# Altium schematic sheet 02_Battery.SchDoc
size A4
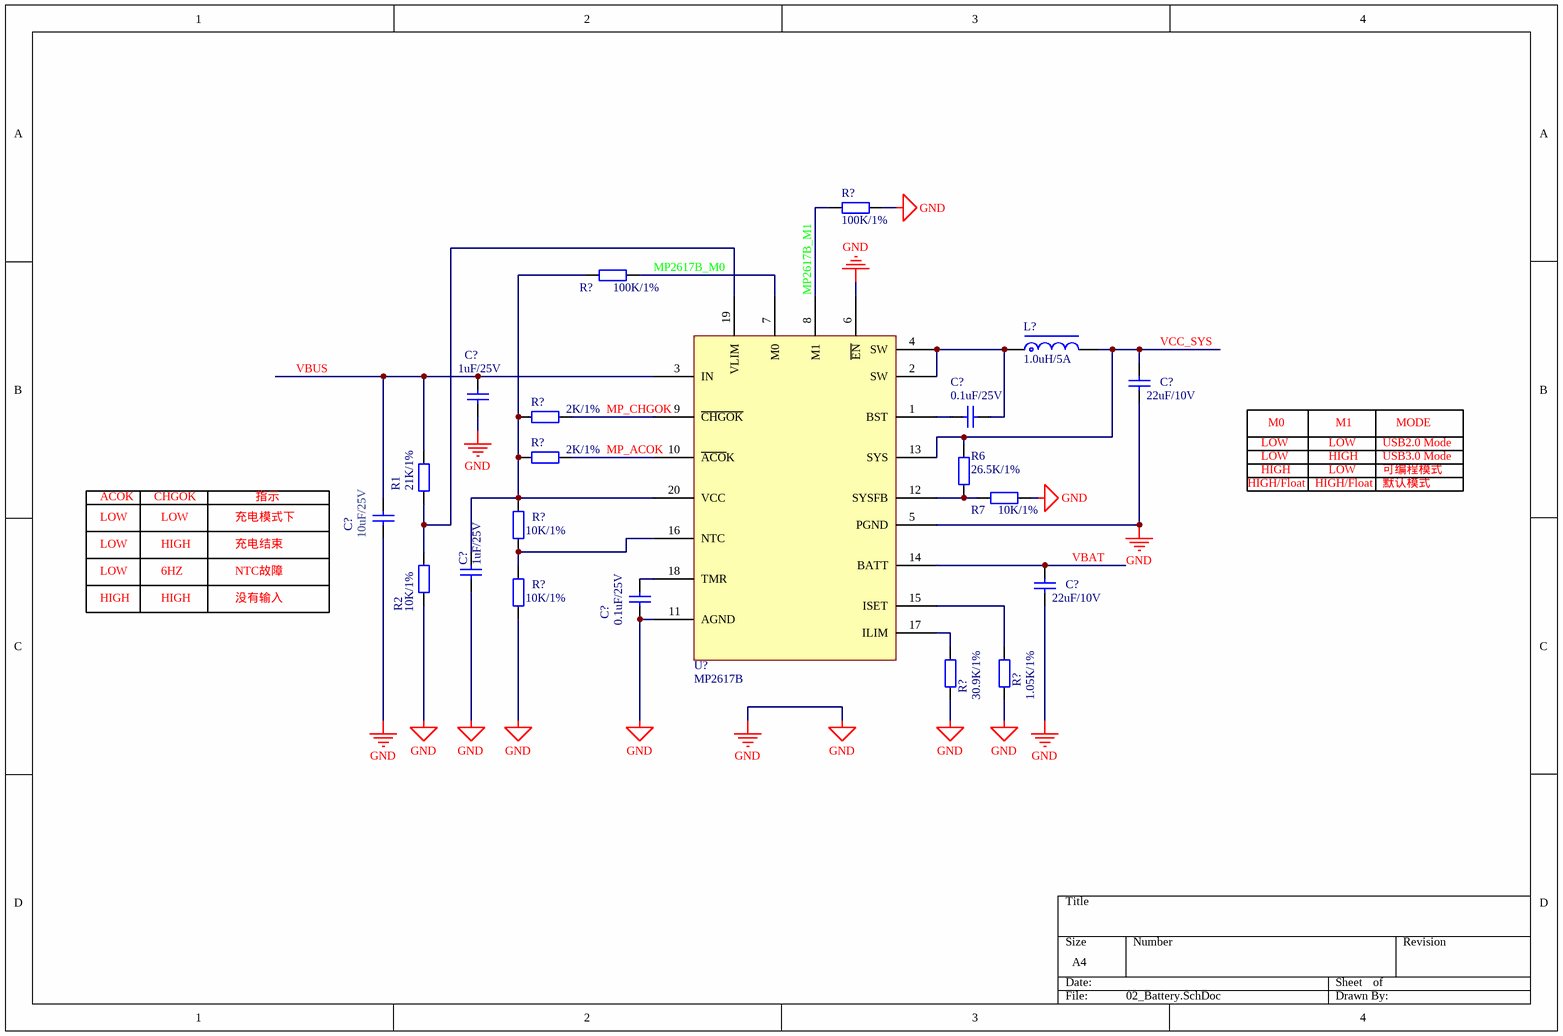
[diagram p0: 02_Battery.SchDoc]

## Parts
(Parts that share a designator on the sheet are numbered #1, #2 ... from top to bottom, then left to right.)
C?#1  22uF/10V  [C0603_L]
C?#2  1uF/25V  [C0402_L]
C?#3  0.1uF/25V  [C0402_L]
C?#4  10uF/25V  [C0603_L]
C?#5  1uF/25V  [C0402_L]
C?#6  0.1uF/25V  [C0402_L]
C?#7  22uF/10V  [C0603_L]
L?  1.0uH/5A  [CDRH73]
R1  21K/1%  [R0402_L]
R2  10K/1%  [R0402_L]
R6  26.5K/1%  [R0402_L]
R7  10K/1%  [R0402_L]
R?#1  100K/1%  [R0402_L]
R?#2  100K/1%  [R0402_L]
R?#3  2K/1%  [R0402_L]
R?#4  2K/1%  [R0402_L]
R?#5  10K/1%  [R0402_L]
R?#6  10K/1%  [R0402_L]
R?#7  30.9K/1%  [R0402_L]
R?#8  1.05K/1%  [R0402_L]
U?  MP2617B  [QFN-20]

## Nets
GND: C?#1.1 C?#2.1 C?#4.1 C?#5.1 C?#6.2 C?#7.1 R2.1 R7.2 R?#1.2 R?#6.1 R?#7.1 R?#8.1 U?.5(PGND) U?.6(~{EN}) U?.11(AGND)
MP2617B_M0: R?#2.2 U?.7(M0)
MP2617B_M1: R?#1.1 U?.8(M1)
MP_ACOK: R?#4.2 U?.10(~{ACO}K)
MP_CHGOK: R?#3.2 U?.9(~{CHGOK})
VBAT: C?#7.2 U?.14(BATT)
VBUS: C?#2.2 C?#4.2 R1.2 U?.3(IN)
VCC_SYS: C?#1.2 L?.2 R6.2 U?.13(SYS)
NetC?#3_1: C?#3.1 L?.1 U?.2(SW) U?.4(SW)
NetC?#3_2: C?#3.2 U?.1(BST)
NetC?#5_2: C?#5.2 R?#2.1 R?#3.1 R?#4.1 R?#5.2 U?.20(VCC)
NetC?#6_1: C?#6.1 U?.18(TMR)
NetR1_1: R1.1 R2.2 U?.19(VLIM)
NetR6_1: R6.1 R7.1 U?.12(SYSFB)
NetR?#5_1: R?#5.1 R?#6.2 U?.16(NTC)
NetR?#7_2: R?#7.2 U?.17(ILIM)
NetR?#8_2: R?#8.2 U?.15(ISET)

## Notes on the sheet
- LOW
- M0
- M1
- USB2.0 Mode
- MODE
- ACOK
- CHGOK
- 充电模式下
- 指示
- HIGH/Float
- HIGH
- USB3.0 Mode
- 可编程模式
- 默认模式
- 6HZ
- 充电结束
- NTC故障
- 没有输入

## Library data of the parts
C?#1-C?#7 = C: 贴片电容; BOM名称: 无极性贴片电容; 联系卖家，免费查找封装: 唯一出售店铺网址https://shop463601444.taobao.com
L? = L-CDRH: CDRH功率屏蔽电感; BOM名称: 功率屏蔽电感; 联系卖家，免费查找封装: 唯一出售店铺网址https://shop463601444.taobao.com
R1 R2 R6 R7 R?#1-R?#8 = R: 贴片电阻; 联系卖家，免费查找封装: 唯一出售店铺网址https://shop463601444.taobao.com; BOM名称: 贴片电阻
U? = MP2617B: 锂电池充电IC，电源路径管理